# EAGLE design Adafruit LSM9DS1 Rev C (EAGLE 9.6.1)
COMPANY: ADAFRUIT INDUSTRIES; DRAWN: KTOWN; REV: A
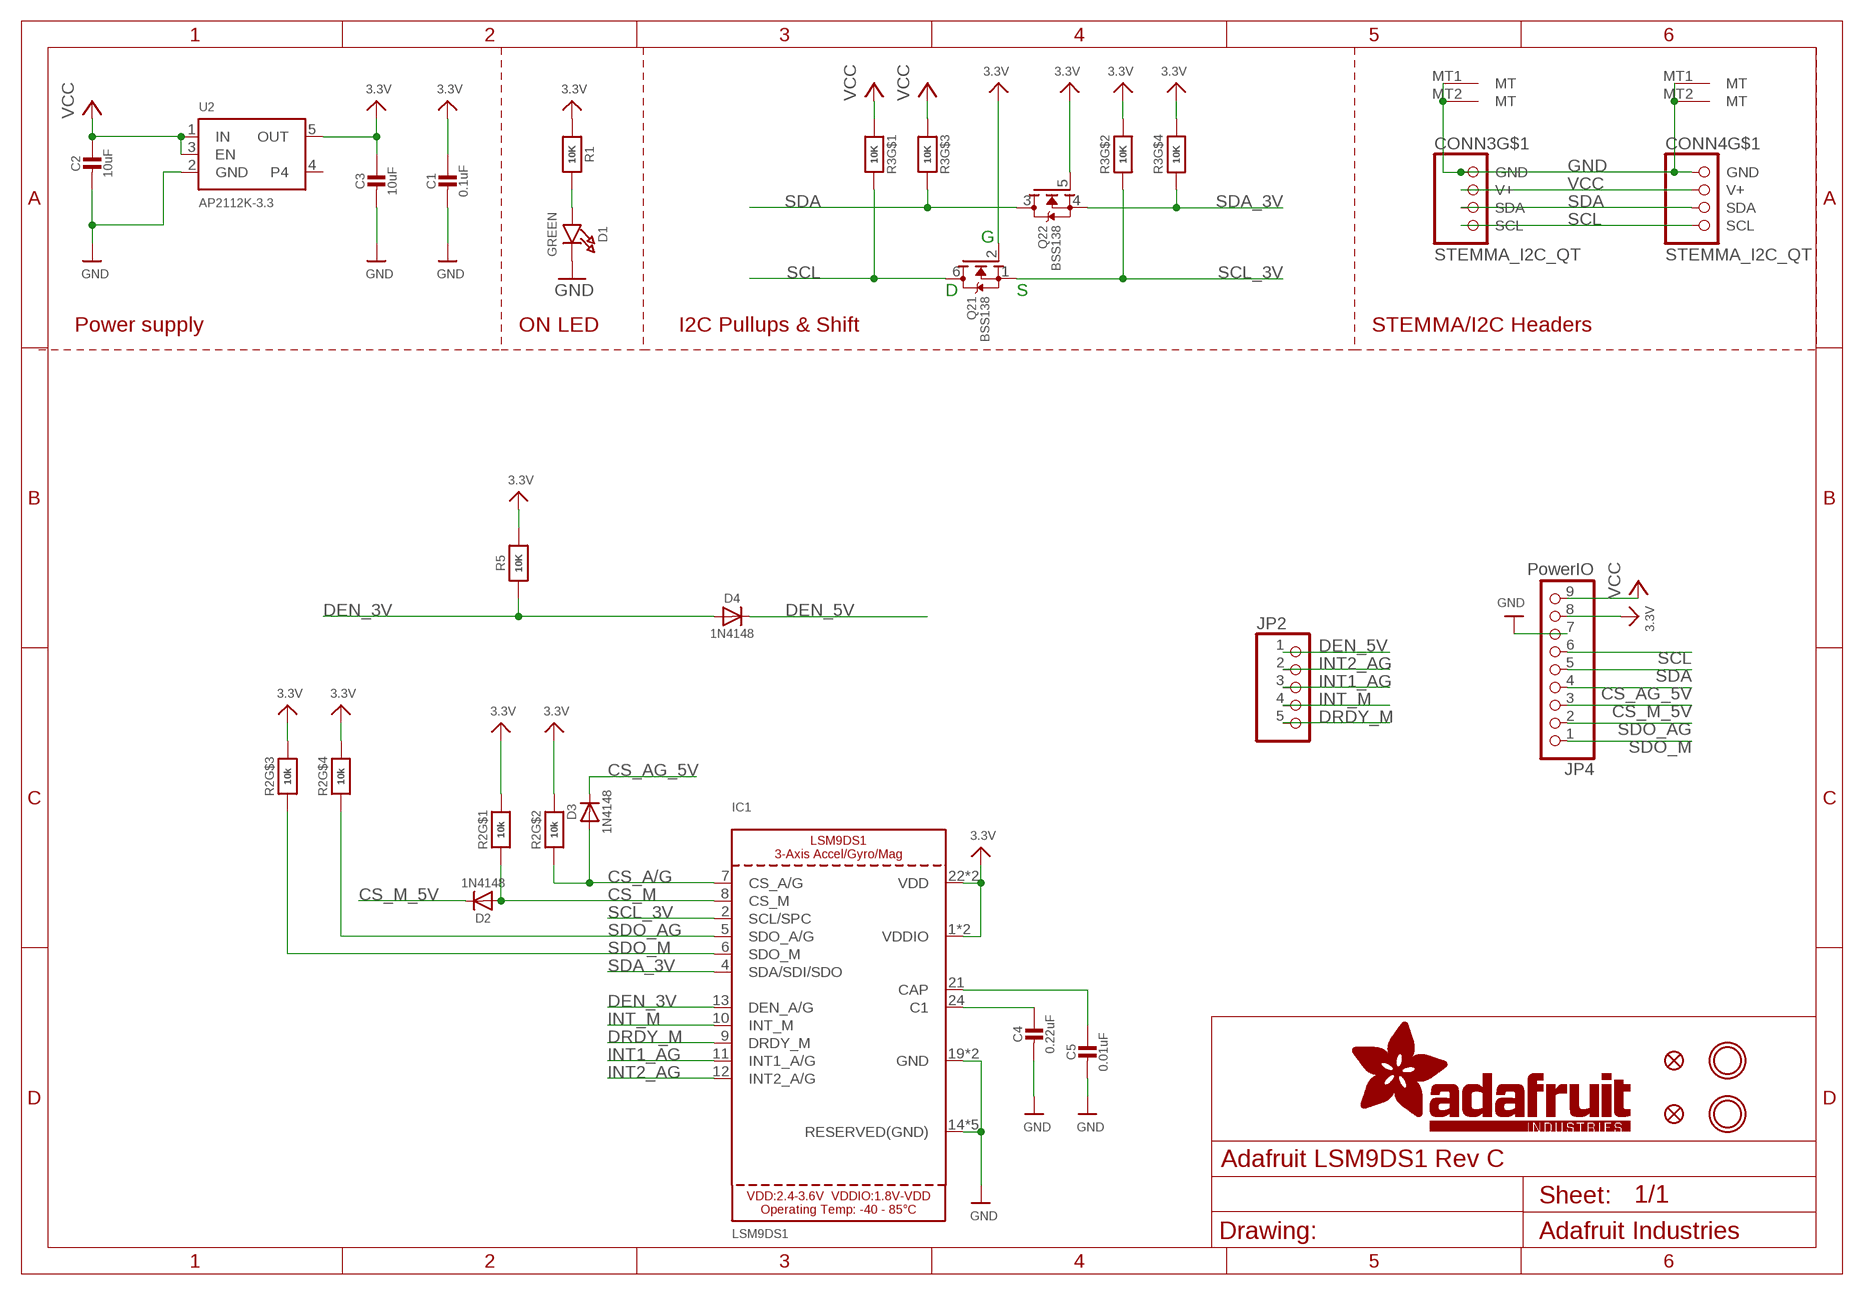
[diagram p0: schematic, sheet 1]

## Parts
C1  0.1uF  CAP_CERAMIC0603_NO  [0603-NO]
C2  10uF  CAP_CERAMIC_0805MP  [_0805MP]
C3  10uF  CAP_CERAMIC0805-NOOUTLINE  [0805-NO]
C4  0.22uF  CAP_CERAMIC0603_NO  [0603-NO]
C5  0.01uF  CAP_CERAMIC0603_NO  [0603-NO]
CONN3  STEMMA_I2C_QT  [JST_SH4]
CONN4  STEMMA_I2C_QT  [JST_SH4]
D1  GREEN  LED0603_NOOUTLINE  [CHIPLED_0603_NOOUTLINE]
D2  1N4148  DIODESOD-323  [SOD-323]
D3  1N4148  DIODESOD-323  [SOD-323]
D4  1N4148  DIODESOD-323  [SOD-323]
FID3  FIDUCIAL_1MM  [FIDUCIAL_1MM]
FID4  FIDUCIAL_1MM  [FIDUCIAL_1MM]
IC1  LSM9DS1  [LGA24_3.5X3.1MM]
JP2  HEADER-1X570MIL  [1X05_ROUND_70]
JP4  PowerIO  HEADER-1X970MIL  [1X09_ROUND_70]
Q2  BSS138  MOSFET-N_DUAL  [SOT363]
R1  10K  RESISTOR_0603_NOOUT  [0603-NO]
R2  10k  RESISTOR_4PACK  [RESPACK_4X0603]
R3  10K  RESISTOR_4PACK  [RESPACK_4X0603]
R5  10K  RESISTOR_0603_NOOUT  [0603-NO]
U2  AP2112K-3.3  VREG_SOT23-5  [SOT23-5]
U$1  MOUNTINGHOLE2.5  [MOUNTINGHOLE_2.5_PLATED]
U$17  MOUNTINGHOLE2.5  [MOUNTINGHOLE_2.5_PLATED]

## Nets
3.3V [lowpower]: C1.1 C3.1 IC1.1(VDDIO) IC1.3(VDDIO) IC1.22(VDD) IC1.23(VDD) JP4.8 Q2.2(1:G) Q2.5(2:G) R1.1 R2.5 R2.6 R2.7 R2.8 R3.2 R3.4 R5.2 U2.5(OUT)
C1: C4.1 IC1.24(C1)
CAP: C5.1 IC1.21(CAP)
CS_A/G: D3.A IC1.7(CS_A/G) R2.2
CS_AG_5V: D3.C JP4.4
CS_M: D2.A IC1.8(CS_M) R2.1
CS_M_5V: D2.C JP4.3
DEN_3V: D4.A IC1.13(DEN_A/G) R5.1
DEN_5V: D4.C JP2.1
DRDY_M: IC1.9(DRDY_M) JP2.5
GND [lowpower]: C1.2 C2.2 C3.2 C4.2 C5.2 CONN3.1(GND) CONN3.MT1(MT) CONN3.MT2(MT) CONN4.1(GND) CONN4.MT1(MT) CONN4.MT2(MT) D1.C IC1.14(RESERVED(GND)) IC1.15(RESERVED(GND)) IC1.16(RESERVED(GND)) IC1.17(RESERVED(GND)) IC1.18(RESERVED(GND)) IC1.19(GND) IC1.20(GND) JP4.7 U2.2(GND)
INT1_AG: IC1.11(INT1_A/G) JP2.3
INT2_AG: IC1.12(INT2_A/G) JP2.2
INT_M: IC1.10(INT_M) JP2.4
N$1: D1.A R1.2
SCL: CONN3.4(SCL) CONN4.4(SCL) JP4.6 Q2.6(1:D) R3.8
SCL_3V: IC1.2(SCL/SPC) Q2.1(1:S) R3.7
SDA: CONN3.3(SDA) CONN4.3(SDA) JP4.5 Q2.3(2:D) R3.6
SDA_3V: IC1.4(SDA/SDI/SDO) Q2.4(2:S) R3.5
SDO_AG: IC1.5(SDO_A/G) JP4.2 R2.4
SDO_M: IC1.6(SDO_M) JP4.1 R2.3
VCC: C2.1 CONN3.2(V+) CONN4.2(V+) JP4.9 R3.1 R3.3 U2.1(IN) U2.3(EN)
Unconnected: U2.4

## Notes on the sheet
- G
- D | S
- Power supply | ON LED | I2C Pullups & Shift | STEMMA/I2C Headers

## Library data of the parts
C1-C5 = microbuilder:CAP_CERAMIC: Ceramic Capacitors For new designs, use the packages preceded by an '_' character since they are more reliable: The following footprints should be used on most boards: _0402 - Standard footprint for regular board layouts _0603 - Standard footprint for regular board layouts _0805 - Standard footprint for regular board layouts _1206 - Standard footprint for regular board layouts For extremely tight-pitch boards where space is at a premium, the following 'micro-pitch' footprints can be used (smaller pads, no silkscreen outline, etc.): _0402MP - Micro-pitch footprint for very dense/compact boards _0603MP - Micro-pitch footprint for very dense/compact boards _0805MP - Micro-pitch footprint for very dense/compact boards _1206MP - Micro-pitch footprint for very dense/compact boards
CONN3 CONN4 = microbuilder:STEMMA_I2C
D1 = microbuilder:LED: LED 0603 - 0603 Surface Mount Package 2mA: Green LED - Low Power (3.9mcd, 2ma, 1.7Vf) - Digikey: 475-2709-2-ND Orange LED - Low Power (9.8mcd, 2ma, 1.8Vf) - Digikey: 475-1194-2-ND Red LED - Low Power (5mcd, 2ma, 1.8Vf) - Digikey: 475-1195-2-ND Yellow LED - Low Power (7mcd, 2ma, 1.8Vf) - Digikey: 475-1196-2-ND 5mA: Blue LED - Low Power (17mcd, 5ma, 2.9Vf) - Digikey: LNJ937W8CRACT-ND 0805 - 0805 Surface Mount Package 2mA: Red LED (8.8mcd, 2mA, 1.8Vf, Clear) - Low Power [Digikey: 475-2510-1-ND] Green LED (5mcd, 2mA, 1.8Vf, Clear) - Low Power [Digikey: 475-2730-1-ND] Yellow LED (11.3mcd, 2mA, 1.8Vf, Clear) - Low Power [Digikey: 475-2555-1-ND] 20mA: Red LED (104mcd, 20mA, Diffused) - LS R976 [Digikey: 475-1278-6-ND] Red LED (12mcd, 20mA, 2.0Vf, Clear) - APT2012EC [Digikey: 754-1128-1-ND] Green LED (15mcd, 20mA, 2.2Vf, Clear) - APT2012GC [Digikey: 754-1131-1-ND] Orange LED (160mcd, 20mA, 2.1Vf, Clear) - APT2012SECK [Digikey: 754-1130-1-ND] 1206 - 1206 Surface Mount Package Green LED (26mcd, 20mA, Diffused) - LG N971 [Digikey: 475-1407-6-ND] Red LED (15mcd, 20mA, Diffused) - LH N974 [Digikey: 475-1416-6-ND] Cree - Cree High-Power Surface Mount LEDs XPEBWT-L1-0000-00D50 - White 111lm 350mA 2.9Vf 6200K 110° XTEAWT-00-0000-00000LEE3 - White 114lm 350mA 2.85Vf 5000K 115° Everlight - Everlight 45-21 Series Surface Mount LEDs 45-21/QK2C-B2832AC2CB2/2T - Warm White 2000mcd 20mA 3.25Vf 3050K 120° 45-21/LK2C-B38452C4CB2/2T - Nuetral White 2000mcd 20mA 3.25Vf 4150K 120° 45-21/LK2C-B50634C6CB2/2T - Cold White 2200mcd 20mA 3.25Vf 5650K 120° PLCC2 Reverse Mount LS T77K-J1L2-1-0-2-R18-Z - Red 11.25mcd 2mA 1.8Vf 630nm 120° LO T77K-L1M2-24-Z - Orange 19.6mcd 2mA 1.8Vf 606nm 120° LY T77K-K2M1-26-Z - Yellow 15.7mcd 2mA 1.8Vf 587nm 120°
D2-D4 = microbuilder:DIODE: Diode SMA Model Volts Amps Type Vf Ir Digikey # Notes SSA34-E3 40V 3A Schottky 480mV @ 3A 200uA @ 40V SSA34-E3/61TGITR-ND CDBA120-G 20V 1A Schottky 500mV @ 1A 500uA @ 20V 641-1014-6-ND REEL MBRA210 10V 2A Schottky 350mV @ 2A 700uA @ 10V MBRA210LT3 SOD-123 Model Volts Amps Type Vf Ir Order # Notes BAT54T1G 30V 200mA Schottky 800mV @ 200mA 2uA @ 25V BAT54T1GOSTR-ND B0530W 30V 500mA Schottky 430mV @ 500mA 130uA @ 30V B0530W-FDICT-ND REEL MBR120 20V 1A Schottky 340mV @ 1A MBR120VLSFT1GOSCT-ND SOD-323 Model Volts Amps Type Vf Ir Order # Notes PMEG2005EJ 20V 500mA Schottky 355mV @ 500mA 568-4110-1-ND ZLLS410 10V 570mA Schottky 380mV @ 570mA ZLLS410CT-ND 1N4148WS 75V 150mA Silicon/Simple 1V 1N4148WSFSCT-ND REEL SOD-523 Model Volts Amps Type Vf Ir Order # Notes BAT54XV2 30V 200mA Schottky 0.8V @ 100mA BAT54XV2CT-ND TB751S 30V 30mA Schottky RB751S-40TE61CT-ND SOT23-R/W (R = Solder Paste/Reflow Ovens, W = Hand-Soldering) Model Volts Amps Type Vf Ir Order # Notes BAT54FILM 40V 300mA Schottky 497-7162-1-ND POWERDI-5 Model Volts Amps Type Vf Ir Order # Notes PDS560 60V 5A Schottky 670mV @ 5A 150uA @ 60V PDS560DICT-ND
FID3 FID4 = microbuilder:FIDUCIAL: Fiducial Alignment Points Various fiducial points for machine vision alignment.; BOM: EXCLUDE
IC1 = microbuilder:LSM9DS1
JP2 = microbuilder:HEADER-1X5: PIN HEADER
JP4 = microbuilder:HEADER-1X9: PIN HEADER
Q2 = microbuilder:MOSFET-N_DUAL: Dual N-Channel MOSFET SOT363 (2.0x1.25mm) 2N7002PS - 60V, 320mA [Digikey: 568-5984-1-ND]
R1 R5 = microbuilder:RESISTOR: Resistors For new designs, use the packages preceded by an '_' character since they are more reliable: The following footprints should be used on most boards: _0402 - Standard footprint for regular board layouts _0603 - Standard footprint for regular board layouts _0805 - Standard footprint for regular board layouts _1206 - Standard footprint for regular board layouts For extremely tight-pitch boards where space is at a premium, the following 'micro-pitch' footprints can be used (smaller pads, no silkscreen outline, etc.): _0402MP - Micro-pitch footprint for very dense/compact boards _0603MP - Micro-pitch footprint for very dense/compact boards _0805MP - Micro-pitch footprint for very dense/compact boards _1206MP - Micro-pitch footprint for very dense/compact boards
R2 R3 = microbuilder:RESISTOR_4PACK: Resistor Packs (4 resistors) 4 x 0603 10K 1/16W - Digikey: YC164J-10KCT-ND
U2 = microbuilder:VREG_SOT23-5: SOT23-5 Fixed Voltage Regulators Part Current Out V Out V In V Dropout θJA (°C/W) TJ (°C) Digikey Part No. ADP121 150mA 3.3V 3.4-5.5V 0.09V @ 150mA -- -- ADP121-AUJZ33R7CT-ND ADP121 150mA 3.0V 3.1-5.5V 0.09V @ 150mA -- -- ADP121-AUJZ30R7CT-ND ADP122 300mA 3.3V 3.4-5.5V 0.085V @ 300mA -- -- ADP122AUJZ-3.3-R7CT-ND ADP1712 300mA 3.3V 3.5-5.5V 0.17V @ 300mA -- -- ADP1712AUJZ-3.3-R7TR-ND AP7311 (Low Cost) 150mA 3.3V 3.5-6V 0.15V @ 150mA -- -- AP7311-33WG-7DICT-ND LD39015M18R 150mA 1.8V 1.9V-5.5V 0.08V @ 100mA -- -- 497-6977-1-ND LP2985A-33DBVR 150mA 3.3V 3.3-16V 0.28V @ 150mA 206 150 296-18479-1-ND MCP1824T-3302E/OT 300mA 3.3V 3.5V-6V 0.2V @ 300mA -- -- MCP1824T-3302E/OTCT-ND MIC5205-2.5YM5 TR 150mA 2.5V 2.7-16V 0.165V @ 150mA -- -- 576-1257-2-ND MIC5205-3.0YM5 TR 150mA 3.0V 3.2V-16V 0.165V @ 150mA -- -- 576-1258-2-ND MIC5205-3.3YM5 TR 150mA 3.3V 3.5V-16V 0.165V @ 150mA -- -- 576-1259-2-ND TPS780330220 150mA 3.3V+2.2V 3.6-5.5V 250mV Max -- -- 296-23332-1-ND TDA3663/N1,135 100mA 3.3V 3.5-45V 0.18V @ 50mA -- -- 568-5343-1-ND Max operating temp can be calculated using θJA, TJ (max junction temperature), and power in watts. Set the "Maximum Ambient Temperature" until it reaches TJ ("Max Junction Temperature"), which is the absolute limit for safe use of the regulator: Heat Sink Temperature Calculator <http://www.daycounter.com/Calculators/Heat-Sink-Temperature-Calculator.phtml> For example, With 12V source into a 3.3V LP2985 and a 30mA load, we are dissipating (12V-3.3V) * 0.03A = 0.261W. With a θJA of 206 °C/W, a TJ of 150°C, and 261mW we can safely use the chip without a heat sink up to 75°C (=147.1°C Junction Temperature).
U$1 U$17 = microbuilder:MOUNTINGHOLE: Mounting Hole For #2 screws (0.086"/2.18mm width, 0.094"/2.4mm hole) use 2.5mm; BOM: EXCLUDE

## Net classes
1 highpower: width 0.406 mm, drill 0.381 mm
2 lowpower: width 0.254 mm, drill 0.381 mm

## Board
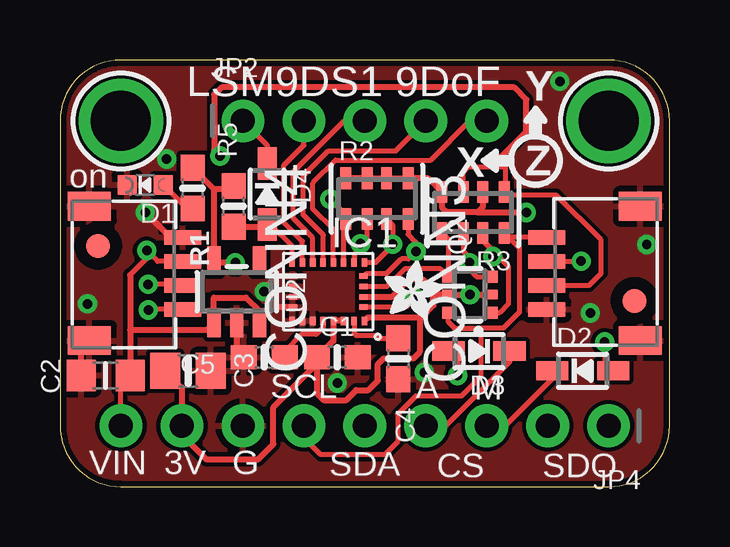
[diagram p1: board, top side]
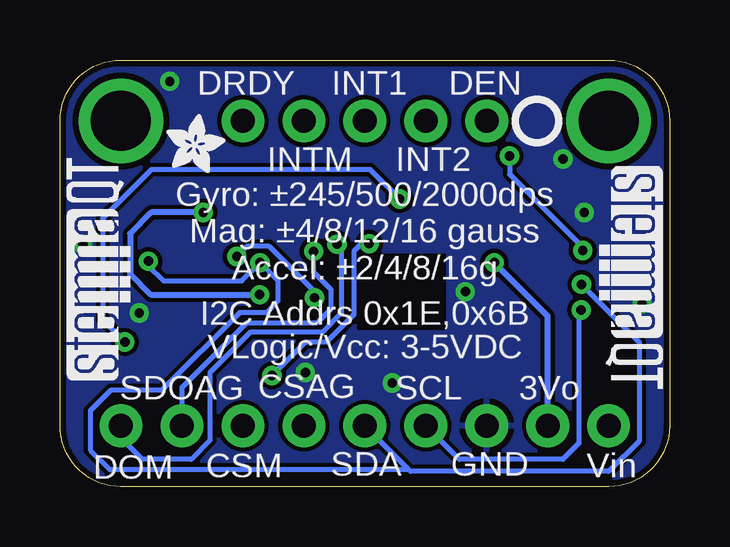
[diagram p2: board, bottom side, seen from below]

Size 25.4 x 17.78 mm. Coordinates in mm from the lower left corner, seen from the top.
Outline: 0,15.24 0,2.54 arc90 2.54,0 22.86,0 arc90 25.4,2.54 25.4,15.24 arc90 22.86,17.78 2.54,17.78 arc90 0,15.24
Copper layers (1*16): Top 0.035mm / dielectric 1.5mm / Bottom 0.035mm
Design rules "adafruit *": minimum track width 8mil, minimum drill 15.5mil, track to track 7mil, track to pad 7mil, pad to pad 7mil, via to via 7mil, smd to smd 7mil, copper to edge 10mil, drill to drill 8mil, minimum pad ring 10mil, minimum via ring 8mil, stop-mask expansion 2mil, vias tented up to drill 20mil, thermal gap 10mil
bRestrict: area 9.3,6.5 to 13,9.7

### Footprints (pad centres in the part's own frame; a part is rotated, then mirrored left to right if it is on the bottom)
0603-NO = smd 1.075 x 1: 1 -0.85,0; 2 0.85,0
_0805MP = smd 1.2 x 1.3: 1 -1.016,0; 2 1.016,0
0805-NO = smd 1.24 x 1.5: 1 -0.95,0; 2 0.95,0
JST_SH4 = smd 0.6 x 1.55: 1 -1.5,2.514; 2 -0.5,2.514; 3 0.5,2.514; 4 1.5,2.514 | smd 1.2 x 1.8: MT1 -2.8,-1.386; MT2 2.8,-1.386
CHIPLED_0603_NOOUTLINE = smd 0.8 x 0.8: A 0,-0.75; C 0,0.75
SOD-323 = smd 1.35 x 0.8: A 1.27,0; C -1.27,0
FIDUCIAL_1MM = smd 1 x 1: 1 0,0
LGA24_3.5X3.1MM = smd 0.23 x 0.35: 1 -1.505,1.22; 6 -1.505,-1.22; 7 -1.075,-1.22; 8 -0.645,-1.22; 9 -0.215,-1.22; 10 0.215,-1.22; 11 0.645,-1.22; 12 1.075,-1.22; 13 1.505,-1.22; 18 1.505,1.22; 19 1.075,1.22; 20 0.645,1.22; 21 0.215,1.22; 22 -0.215,1.22; 23 -0.645,1.22; 24 -1.075,1.22 | smd 0.35 x 0.23: 2 -1.475,0.645; 3 -1.475,0.215; 4 -1.475,-0.215; 5 -1.475,-0.645; 14 1.475,-0.645; 15 1.475,-0.215; 16 1.475,0.215; 17 1.475,0.645
1X05_ROUND_70 = drill 1 pad 1.778: 1 -5.08,0; 2 -2.54,0; 3 0,0; 4 2.54,0; 5 5.08,0
1X09_ROUND_70 = drill 1 pad 1.778: 1 -10.16,0; 2 -7.62,0; 3 -5.08,0; 4 -2.54,0; 5 0,0; 6 2.54,0; 7 5.08,0; 8 7.62,0; 9 10.16,0
SOT363 = smd 0.5 x 0.5: 1 -0.75,-0.9; 3 0.75,-0.9; 4 0.75,0.9; 6 -0.75,0.9 | smd 0.4 x 0.5: 2 0,-0.9; 5 0,0.9
RESPACK_4X0603 = smd 0.45 x 0.9: 1 -1.3,-0.85; 2 -0.4,-0.85; 3 0.4,-0.85; 4 1.3,-0.85; 5 1.3,0.85; 6 0.4,0.85; 7 -0.4,0.85; 8 -1.3,0.85
SOT23-5 = smd 0.55 x 1.2: 1 -0.95,-1.3; 2 0,-1.3; 3 0.95,-1.3; 4 0.95,1.3; 5 -0.95,1.3
MOUNTINGHOLE_2.5_PLATED = drill 2.5 pad 3.2: P$1 0,0

### Placement (x,y rotation side)
C1  11.56,5.4 0 top
C2  1.91,4.64 180 top
C3  5.33,4.83 0 top
C4  14.1,5.33 270 top
C5  8.51,5.4 180 top
CONN3  22.8,8.89 90 top
CONN4  2.6,8.89 270 top
D1  3.56,12.57 90 top
D2  21.78,4.83 0 top
D3  17.46,5.65 180 top
D4  8.64,12.19 270 top
FID3  1.59,10.03 0 top
FID4  23.94,7.75 0 top
IC1  11.18,8.13 180 top
JP2  12.7,15.24 0 top
JP4  12.7,2.54 180 top
Q2  17.08,8 90 top
R1  5.52,12.45 270 top
R2  13.21,12 0 top
R3  17.21,11.43 180 top
R5  7.24,11.68 90 top
U2  7.37,8.13 0 top
U$1  2.54,15.24 0 top
U$10  [ADAFRUIT_2.5MM]  13.53,6.99 0 top
U$16  [ADAFRUIT_2.5MM]  20.95,13.08 0 bottom
U$17  22.86,15.24 0 top
U$25  [PCBFEAT-REV-040]  5.52,15.24 0 bottom
U$30  [STEMMAQT]  22.48,4.45 90 bottom
U$31  [STEMMAQT]  2.92,13.34 270 bottom

### Tracks (layer width: path | path; a pad name or v marks a point on that pad's centre or on a via)
3.3V  (via drill 0.39)
  Top 0.254: R3.2 17.61,11.64 17.4,11.43 | 17.4,11.43 16.13,11.43 15.91,11.65 R3.4 15.34,12.85 R2.5 R2.6 R2.7 R2.8 | 6.42,12.4 R1.1 | U2.5 6.45,9.43 | 6.45,9.43 6.54,9.34 v7.3,9.34 | 6.42,12.4 6.42,9.46 6.45,9.43 | Q2.2 v17.08,8 Q2.5 15.75,8 | C3.1 5.08,4.13 JP4.8 5.08,2.16 6.1,1.14 8.26,1.14 8.89,1.78 8.89,3.3 10.71,5.12 C1.1 | IC1.23 IC1.22 11.39,6.08 C1.1 | IC1.1 12.82,7.05 14.99,7.05 | 14.99,7.05 15.05,7.05 15.56,7.56 15.56,7.94 15.62,8 15.75,8 | IC1.3 13.82,7.91 14.54,8.64 15.11,8.64 15.75,8 | 17.4,11.43 v19.43,11.43 | 14.99,7.05 14.99,5.6 14.72,5.33 13.48,5.33 13.25,5.11 13.25,4.42 12.85,4.02 12.34,4.02 11.93,3.61 11,3.61 10.71,3.9 C1.1 | R5.2 7.11,12.4 6.42,12.4
  Bottom 0.254: JP4.8 5.08,7.11 v7.3,9.34 | v19.43,11.43 21.59,11.43 22.48,10.54 22.48,8.87 21.61,8 v17.08,8
C1
  Top 0.203: IC1.24 12.25,6.39 12.34,6.3 13.2,6.3 13.32,6.18 C4.1
CAP
  Top 0.203: IC1.21 10.96,6.64 10.67,6.35 10.06,6.35 9.36,5.65 C5.1
CS_A/G  (via drill 0.39)
  Top 0.203: IC1.7 12.26,9.7 12.65,10.09 | 12.65,10.09 12.81,10.25 R2.2 | 12.65,10.09 12.61,10.13 v12.52,10.13 | D3.A 16.57,5.28 v16.57,4.64
  Bottom 0.203: v12.52,10.13 12.84,10.13 13.15,9.81 13.15,7.17 14.29,6.03 15.17,6.03 v16.57,4.64
CS_AG_5V
  Top 0.203: D3.C 18.73,5.21 16.07,2.54 JP4.4
CS_M  (via drill 0.39)
  Top 0.203: IC1.8 11.82,11.06 R2.1 11.91,11.33 v11.25,11.99 | v22.7,6.03 22.7,5.18 D2.A
  Bottom 0.203: v11.25,11.99 12.46,13.21 21.59,13.21 23.62,11.18 23.62,6.96 v22.7,6.03
CS_M_5V
  Top 0.203: JP4.3 18.54,2.54 20.51,4.51 D2.C
DEN_3V
  Top 0.203: 8.64,10.54 D4.A 8.76,10.92 9.67,10.01 IC1.13
  Top 0.254: R5.1 8.34,10.83 8.64,10.54
DEN_5V
  Top 0.203: JP2.1 8.64,14.22 D4.C
DRDY_M
  Top 0.203: IC1.9 11.39,10.12 11.38,10.13 11.38,10.72 10.54,11.56 10.54,12.66 11.49,13.61 15.45,13.61 17.08,15.24 JP2.5
GND  (via drill 0.39)
  Top 0.254: CONN4.1 4.6,10.39 v3.56,11.43 | U2.2 7.37,5.69 C5.2 | IC1.17 9.02,7.48 8.51,7.99 v8.51,8.13 8.51,8.26 9.03,8.77 IC1.14 | C2.2 0.89,5.76 CONN4.MT2
  other vias: 22.1,7.24 11.56,4.32 1.14,7.62 24.45,10.1 20.83,16.89 4.45,13.65 15.18,4.76
  pour Top: 0,17.78 25.4,17.65 25.4,0.38 0,0
  pour Bottom: 0,17.78 25.4,17.65 25.4,0.38 0,0
INT1_AG
  Top 0.203: IC1.11 10.53,10.37 9.73,11.18 9.73,13.12 11.85,15.24 JP2.3
INT2_AG
  Top 0.203: IC1.12 10.1,10.24 9.32,11.02 9.32,13.39 10.16,14.22 JP2.2
INT_M
  Top 0.203: IC1.10 10.97,9.36 10.97,10.49 10.13,11.33 10.13,12.95 11.18,13.99 13.99,13.99 JP2.4
N$1
  Top 0.203: D1.A 5.28,11.6 R1.2
SCL  (via drill 0.39)
  Top 0.203: CONN3.4 18.7,10.39 R3.8 19.14,9.95 19.14,7.27 18.48,6.6 17.53,6.6 | Q2.6 16.18,6.87 16.45,6.6 17.53,6.6 | CONN4.4 3.68,7.39 v3.68,7.37 | 17.53,6.6 17.53,4.57 16.73,3.77 14.82,3.77 14.07,3.02 14.07,1.88 13.53,1.33 10.86,1.33 10.16,2.03 10.16,2.29
  Top 0.254: 10.16,2.29 JP4.6
  Bottom 0.203: v3.68,7.37 3.79,7.26 3.79,1.8 4.45,1.14 8.76,1.14 JP4.6
SCL_3V  (via drill 0.39)
  Top 0.203: v18.03,9.59 18.28,9.59 18.69,9.19 18.69,7.62 18.32,7.25 Q2.1 | v14.8,7.87 14.4,7.48 IC1.2
  Top 0.254: R3.7 17.61,10.26 18.28,9.59
  Bottom 0.203: v14.8,7.87 14.8,8.13 16.68,10.01 17.61,10.01 v18.03,9.59
SDA  (via drill 0.39)
  Top 0.203: Q2.3 17.35,8.75 17.06,9.04 v17.06,9.34 17.06,9.4 17.14,9.48 16.81,9.82 R3.6 | CONN4.3 5.08,8.43 v3.67,8.43 | CONN3.3 20.29,9.4 v21.72,9.4
  Bottom 0.203: v3.67,8.43 1.27,6.03 1.27,1.91 2.54,0.64 10.79,0.64 10.86,0.7 | 10.86,0.7 JP4.5 | v21.72,9.4 21.72,9.21 21.08,8.57 17.82,8.57 v17.06,9.34 16.32,8.59 16.32,7.75 16.81,7.26 17.92,7.26 21.16,4.02 23.29,4.02 24.13,3.17 24.13,1.52 23.3,0.7 10.86,0.7
SDA_3V
  Top 0.203: IC1.4 13.62,8.34 14.36,9.08 15.86,9.08 Q2.4 16.18,10.31 R3.5
SDO_AG  (via drill 0.39)
  Top 0.203: IC1.5 12.77,8.89 13.62,8.89 14.22,9.49 14.52,9.49 v14.83,9.81 14.83,10.19 14.51,10.52 R2.4
  Bottom 0.203: JP4.2 20.32,4.13 17.63,6.81 14.71,6.81 14.12,7.4 14.12,8.22 14.83,8.94 v14.83,9.81
SDO_M  (via drill 0.39)
  Top 0.203: IC1.6 13.16,9.35 13.86,10.05 v13.86,10.11 13.86,10.9 R2.3
  Bottom 0.203: JP4.1 22.86,2.03 21.97,1.14 19.94,1.14 19.15,1.93 19.15,4.76 17.48,6.43 14.48,6.43 13.67,7.24 13.67,9.92 v13.86,10.11
VCC  (via drill 0.39)
  Top 0.203: R3.3 16.81,13.13 17.02,13.34 17.97,13.34 18.54,13.34 18.54,12.31 R3.1 18.64,12.15 20.68,12.15 22.54,10.29 22.54,8.89 22.04,8.39 CONN3.2 | CONN4.2 4.07,9.39 v3.62,9.84 3.62,9.53 2.92,8.83 | JP4.9 2.54,4.64 C2.1
  Top 0.254: 2.92,6.53 C2.1 | 2.92,8.83 2.92,6.53 | U2.3 8.32,7.3 7.75,7.87 6.42,7.87 U2.1 6.11,6.53 2.92,6.53 | 17.97,13.34 19.43,14.8 19.43,16.13 18.92,16.64 6.73,16.64 6.43,16.33 6.43,14.02 v6.67,13.78
  Bottom 0.203: v3.62,9.84 3.62,9.97 6.67,13.02 v6.67,13.78

### Text on the board
tPlace: LSM9DS1 9DoF | Y | X | Z | on | SCL | A | M | VIN | 3V | G | SDA | CS | SDO
bPlace: DEN | INT1 | DRDY | INT2 | INTM | Gyro: ±245/500/2000dps / Mag: ±4/8/12/16 gauss / Accel: ±2/4/8/16g | I2C Addrs 0x1E,0x6B | VLogic/Vcc: 3-5VDC | 3Vo | SCL | CSAG | SDOAG | Vin | GND | SDA | CSM | DOM